# Altium schematic sheet Microcontroleur.SchDoc
size A4
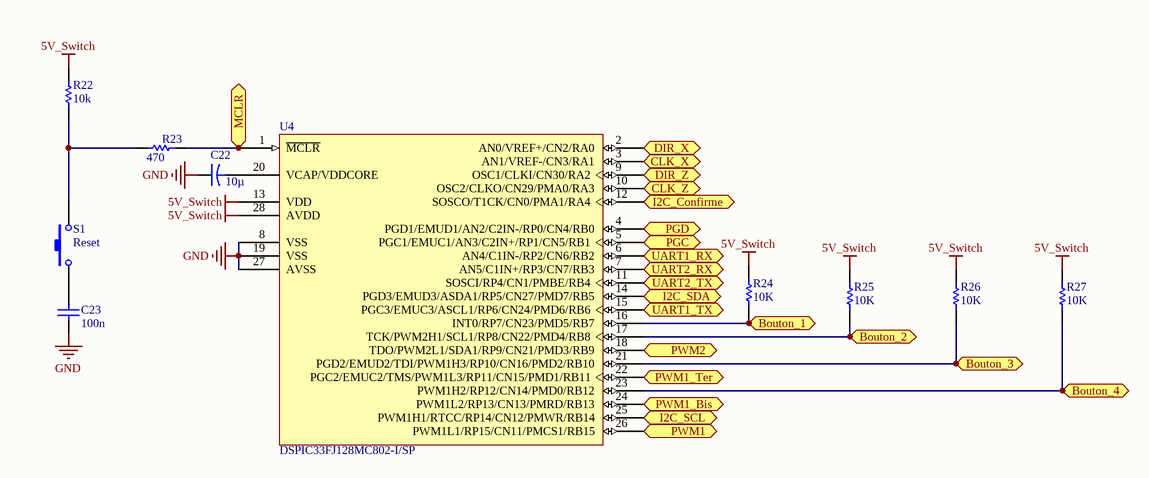
[diagram p0: Microcontroleur.SchDoc]

## Parts
C22  value 10µ  [CAPR5-4X5]  (hidden comment: Cap2)
C23  value 100n  [RAD-0.3]  (hidden comment: Cap)
R22  value 10k  [AXIAL-0.3]  (hidden comment: Res1)
R23  value 470  [AXIAL-0.3]  (hidden comment: Res1)
R24  value 10K  [AXIAL-0.3]  (hidden comment: Res1)
R25  value 10K  [AXIAL-0.3]  (hidden comment: Res1)
R26  value 10K  [AXIAL-0.3]  (hidden comment: Res1)
R27  value 10K  [AXIAL-0.3]  (hidden comment: Res1)
S1  Reset  [SPST-2]
U4  DSPIC33FJ128MC802-I/SP  [SPDIP300-SP28]

## Ports
Bouton_1, Bouton_2, Bouton_3, Bouton_4, CLK_X, CLK_Z, DIR_X, DIR_Z, I2C_Confirme, I2C_SCL, I2C_SDA, MCLR, PGC, PGD, PWM1, PWM1_Bis, PWM1_Ter, PWM2, UART1_RX, UART1_TX, UART2_RX, UART2_TX

## Nets
5V_Switch: R22.2 R24.1 R25.1 R26.1 R27.1 U4.13(VDD) U4.28(AVDD)
GND: C22.1 C23.2 U4.8(VSS) U4.19(VSS) U4.27(AVSS)
Bouton_1: R24.2 U4.16(INT0/RP7/CN23/PMD5/RB7) ; port Bouton_1
Bouton_2: R25.2 U4.17(TCK/PWM2H1/SCL1/RP8/CN22/PMD4/RB8) ; port Bouton_2
Bouton_3: R26.2 U4.21(PGD2/EMUD2/TDI/PWM1H3/RP10/CN16/PMD2/RB10) ; port Bouton_3
Bouton_4: R27.2 U4.23(PWM1H2/RP12/CN14/PMD0/RB12) ; port Bouton_4
CLK_X: U4.3(AN1/VREF-/CN3/RA1) ; port CLK_X
CLK_Z: U4.10(OSC2/CLKO/CN29/PMA0/RA3) ; port CLK_Z
DIR_X: U4.2(AN0/VREF+/CN2/RA0) ; port DIR_X
DIR_Z: U4.9(OSC1/CLKI/CN30/RA2) ; port DIR_Z
I2C_Confirme: U4.12(SOSCO/T1CK/CN0/PMA1/RA4) ; port I2C_Confirme
I2C_SCL: U4.25(PWM1H1/RTCC/RP14/CN12/PMWR/RB14) ; port I2C_SCL
I2C_SDA: U4.14(PGD3/EMUD3/ASDA1/RP5/CN27/PMD7/RB5) ; port I2C_SDA
MCLR: R23.2 U4.1(~{MCLR}) ; port MCLR
PGC: U4.5(PGC1/EMUC1/AN3/C2IN+/RP1/CN5/RB1) ; port PGC
PGD: U4.4(PGD1/EMUD1/AN2/C2IN-/RP0/CN4/RB0) ; port PGD
PWM1: U4.26(PWM1L1/RP15/CN11/PMCS1/RB15) ; port PWM1
PWM1_Bis: U4.24(PWM1L2/RP13/CN13/PMRD/RB13) ; port PWM1_Bis
PWM1_Ter: U4.22(PGC2/EMUC2/TMS/PWM1L3/RP11/CN15/PMD1/RB11) ; port PWM1_Ter
PWM2: U4.18(TDO/PWM2L1/SDA1/RP9/CN21/PMD3/RB9) ; port PWM2
UART1_RX: U4.6(AN4/C1IN-/RP2/CN6/RB2) ; port UART1_RX
UART1_TX: U4.15(PGC3/EMUC3/ASCL1/RP6/CN24/PMD6/RB6) ; port UART1_TX
UART2_RX: U4.7(AN5/C1IN+/RP3/CN7/RB3) ; port UART2_RX
UART2_TX: U4.11(SOSCI/RP4/CN1/PMBE/RB4) ; port UART2_TX
NetC22_2: C22.2 U4.20(VCAP/VDDCORE)
NetC23_1: C23.1 S1.1
NetR22_1: R22.1 R23.1 S1.2

## Library data of the parts
C22 = Cap2: 10µ; Published: 23-Sep-2002; PackageReference: CAPR5-4X5; Publisher: Altium Limited
C23 = Cap: 100n; Published: 8-Jun-2000; LatestRevisionDate: 17-Jul-2002; LatestRevisionNote: Re-released for DXP Platform.; PackageReference: RAD-0.3; Publisher: Altium Limited
R22 R24-R27 = Res1: 10k; Published: 8-Jun-2000; LatestRevisionDate: 17-Jul-2002; LatestRevisionNote: Re-released for DXP Platform.; PackageReference: AXIAL-0.3; Publisher: Altium Limited
R23 = Res1: 470R; Published: 8-Jun-2000; LatestRevisionDate: 17-Jul-2002; LatestRevisionNote: Re-released for DXP Platform.; PackageReference: AXIAL-0.3; Publisher: Altium Limited
S1 = SW-PB: Bouton Reset; Published: 24-Mar-1999; LatestRevisionDate: 17-Jul-2002; LatestRevisionNote: Re-released for DXP Platform.; PackageReference: SPST-2; Publisher: Altium Limited; PackageDescription: Switch; 2 Leads
U4 = DSPIC33FJ128MC802-I/SP: High-Performance 16-bit Digital Signal Controller, 128 KB Flash, 16 KB RAM, 28-Pin SPDIP, Industrial Temperature; FirstPublished: 29-Jan-2009; LatestRevisionDate: 02-Dec-2009; LatestRevisionNote: Updated to datasheet revision D, Nov-2009; DatasheetVersion: revD, Nov-2009; PackageVersion: revBB, Aug-2009; PackageReference: SPDIP300-SP28; Publisher: Altium Limited; PackageDescription: 28-Lead Skinny Plastic Dual In-Line (SP) - 300 mil Body [SPDIP]; Supplier 1: Digi-Key; Supplier Part Number 1: DSPIC33FJ128MC802-I/SP-ND; Supplier 2: Farnell; Supplier Part Number 2: 1576808; Supplier 3: Newark; Supplier Part Number 3: 39M8141; ComponentLink1Description: Datasheet; ComponentLink1URL: http://ww1.microchip.com/downloads/en/DeviceDoc/70291D.pdf; ComponentLink2Description: Packaging Specification; ComponentLink2URL: http://www.microchip.com/stellent/groups/techpub_sg/documents/packagingspec/en012702.pdf; ComponentLink3Description: Microchip.com Home; ComponentLink3URL: http://www.microchip.com/